# Altium schematic sheet 0258_GPU VREG_ VDDQ_GPU.SchDoc
size 848 x 558 mm
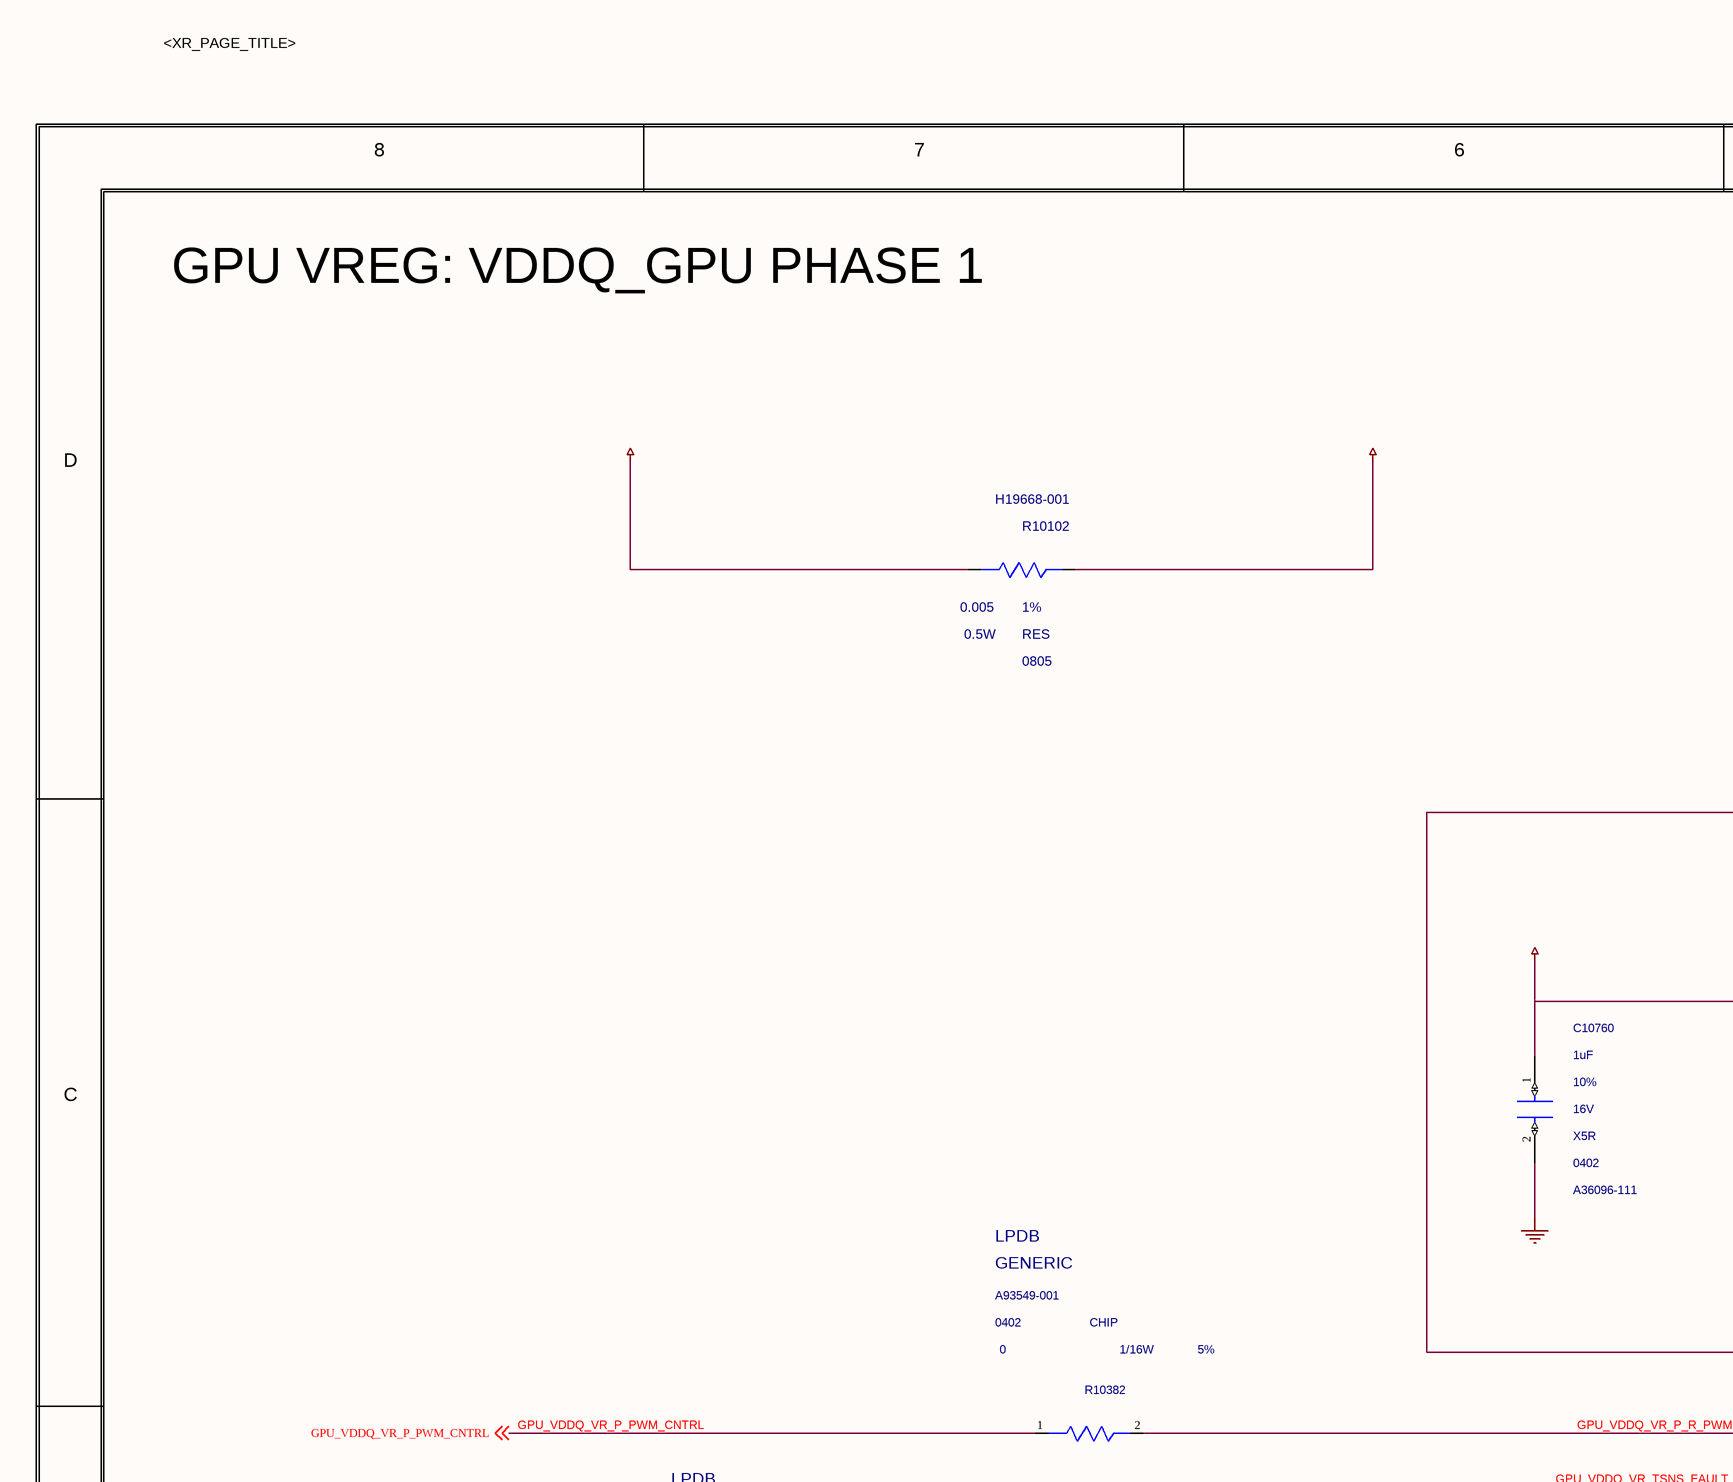
[diagram p0: 0258_GPU VREG_ VDDQ_GPU.SchDoc, top left]
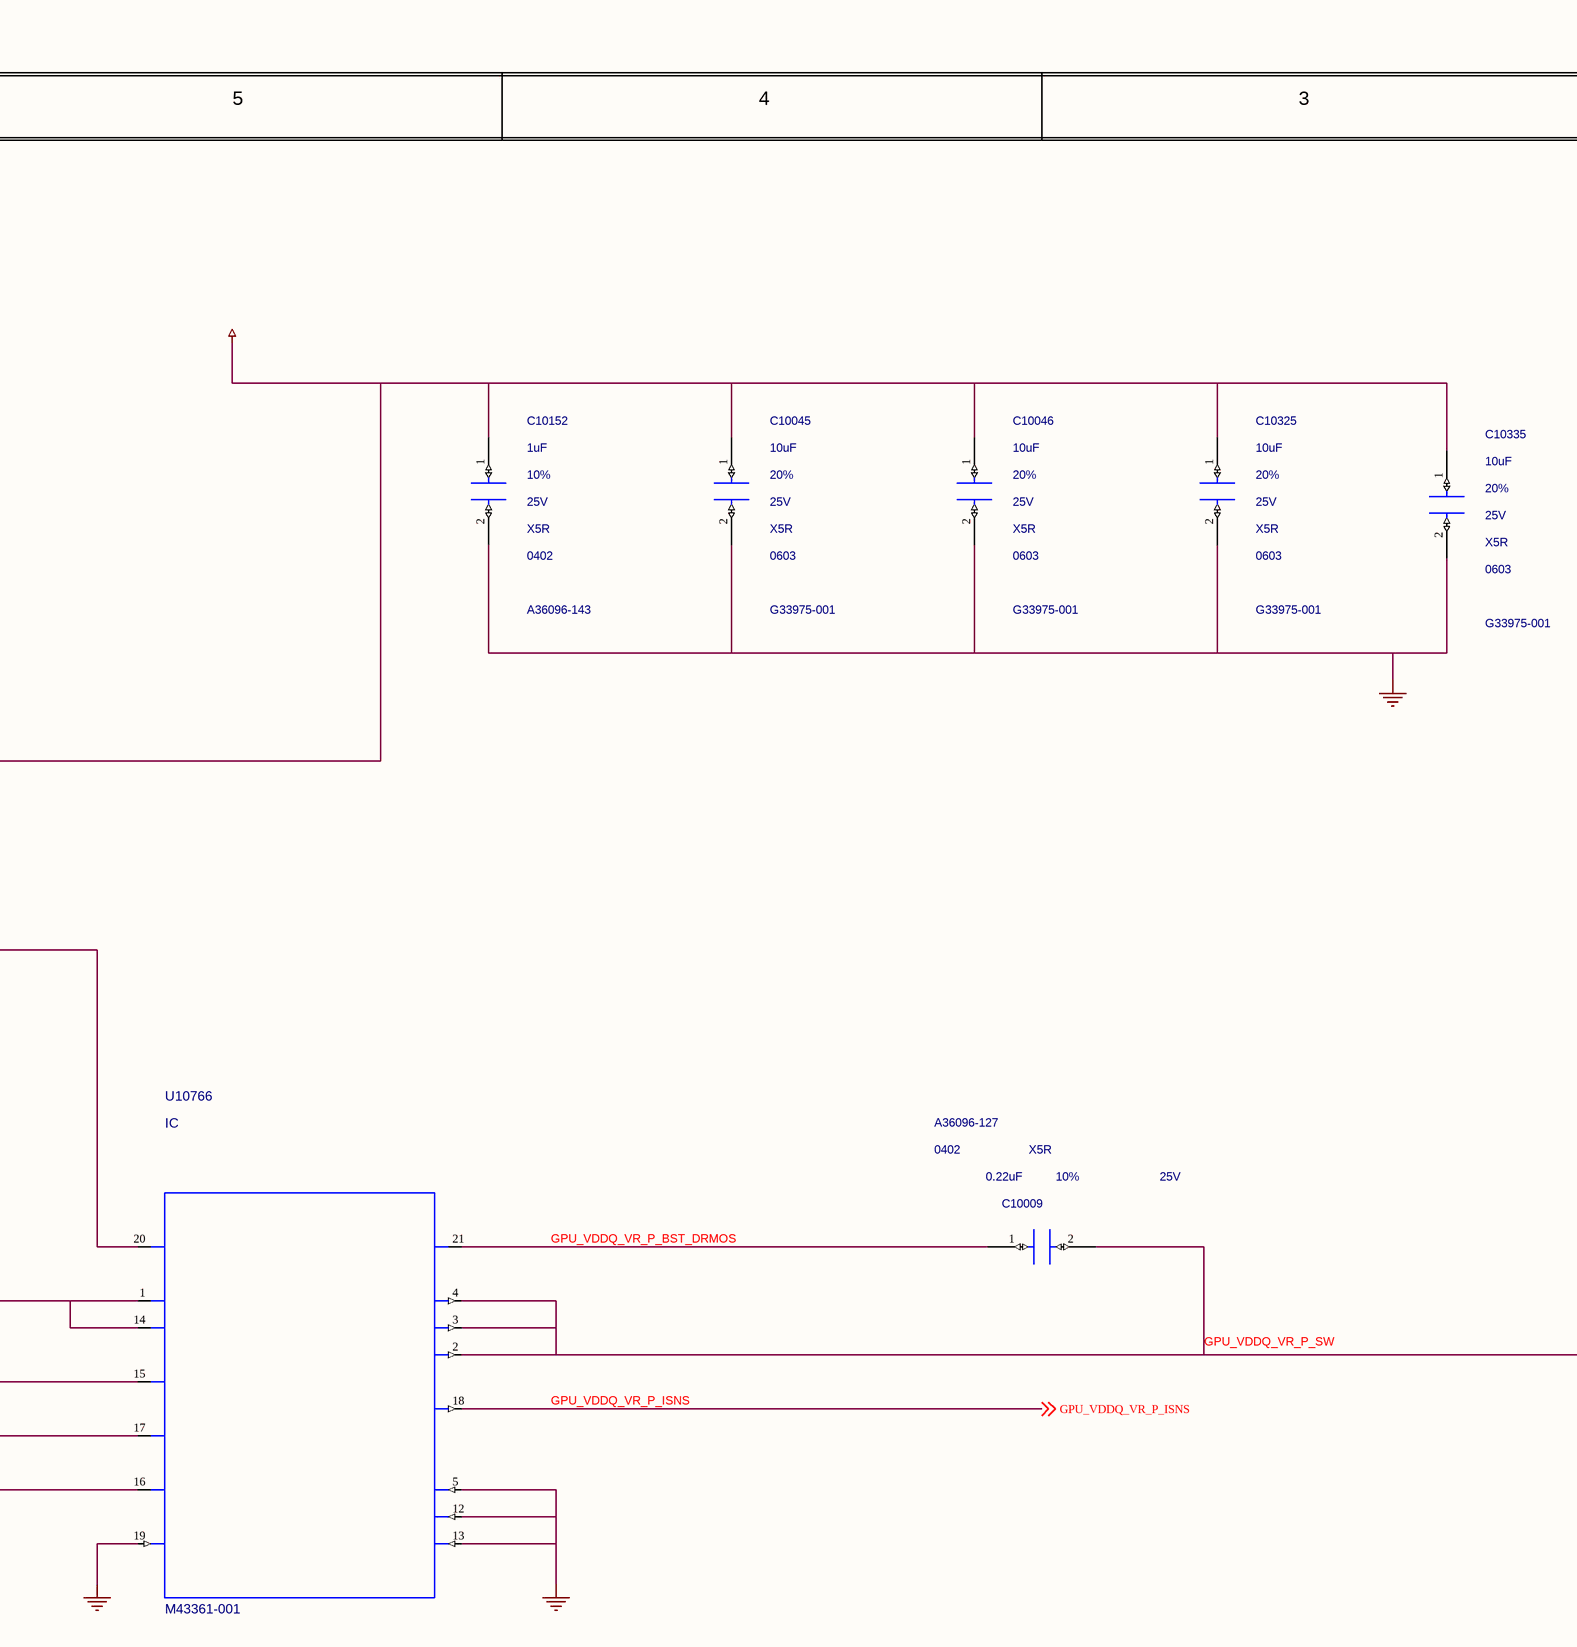
[diagram p1: 0258_GPU VREG_ VDDQ_GPU.SchDoc, top middle]
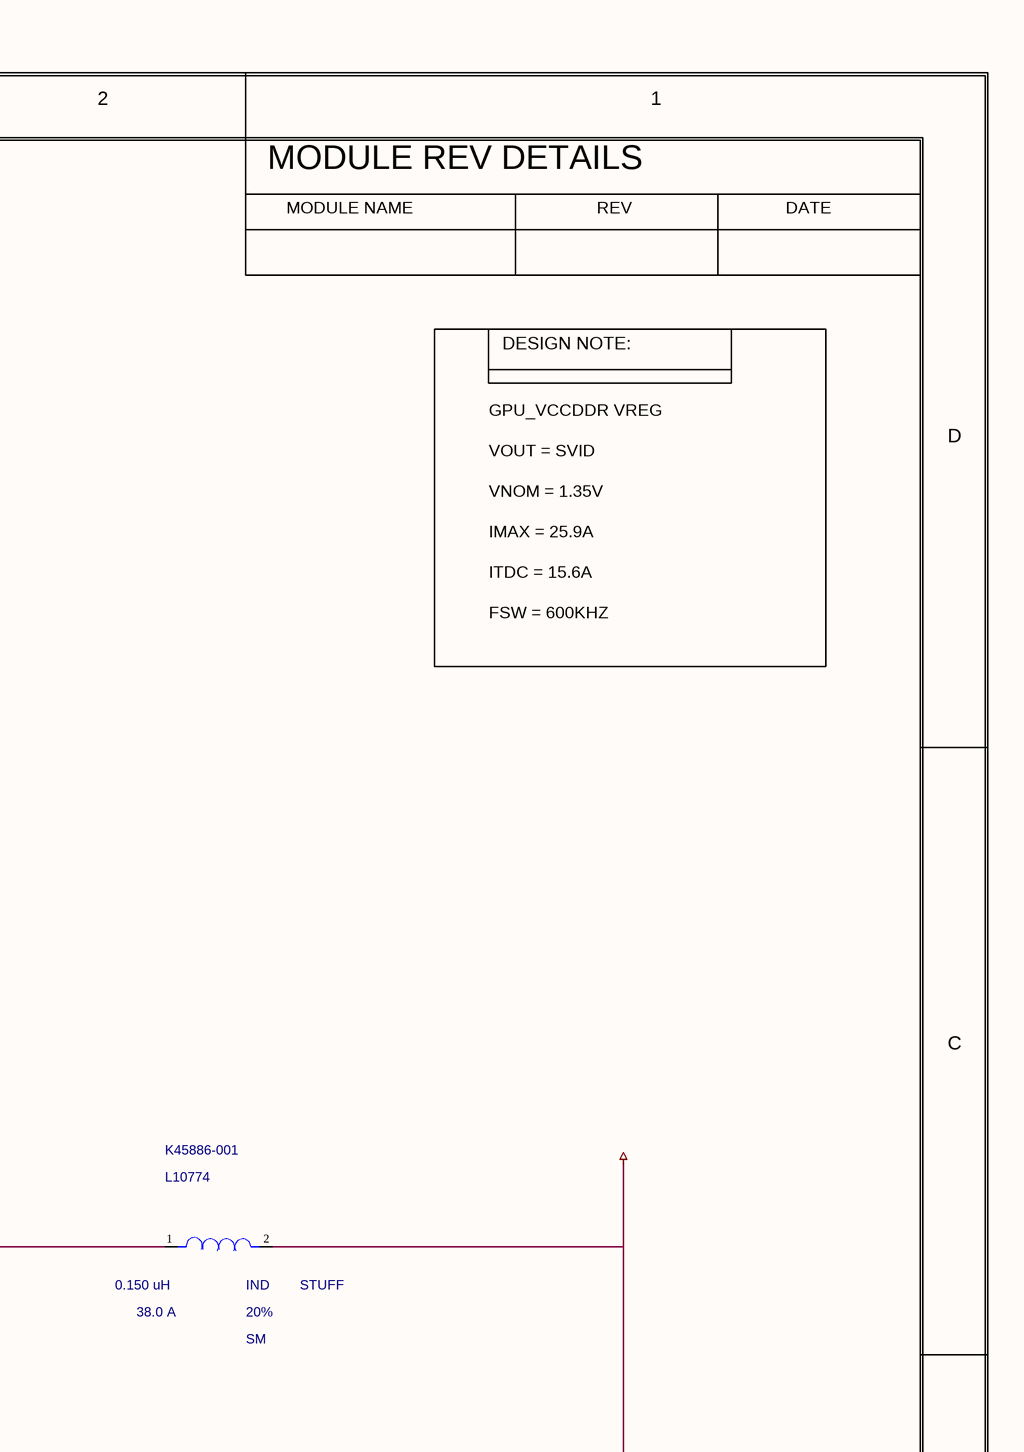
[diagram p2: 0258_GPU VREG_ VDDQ_GPU.SchDoc, top right]
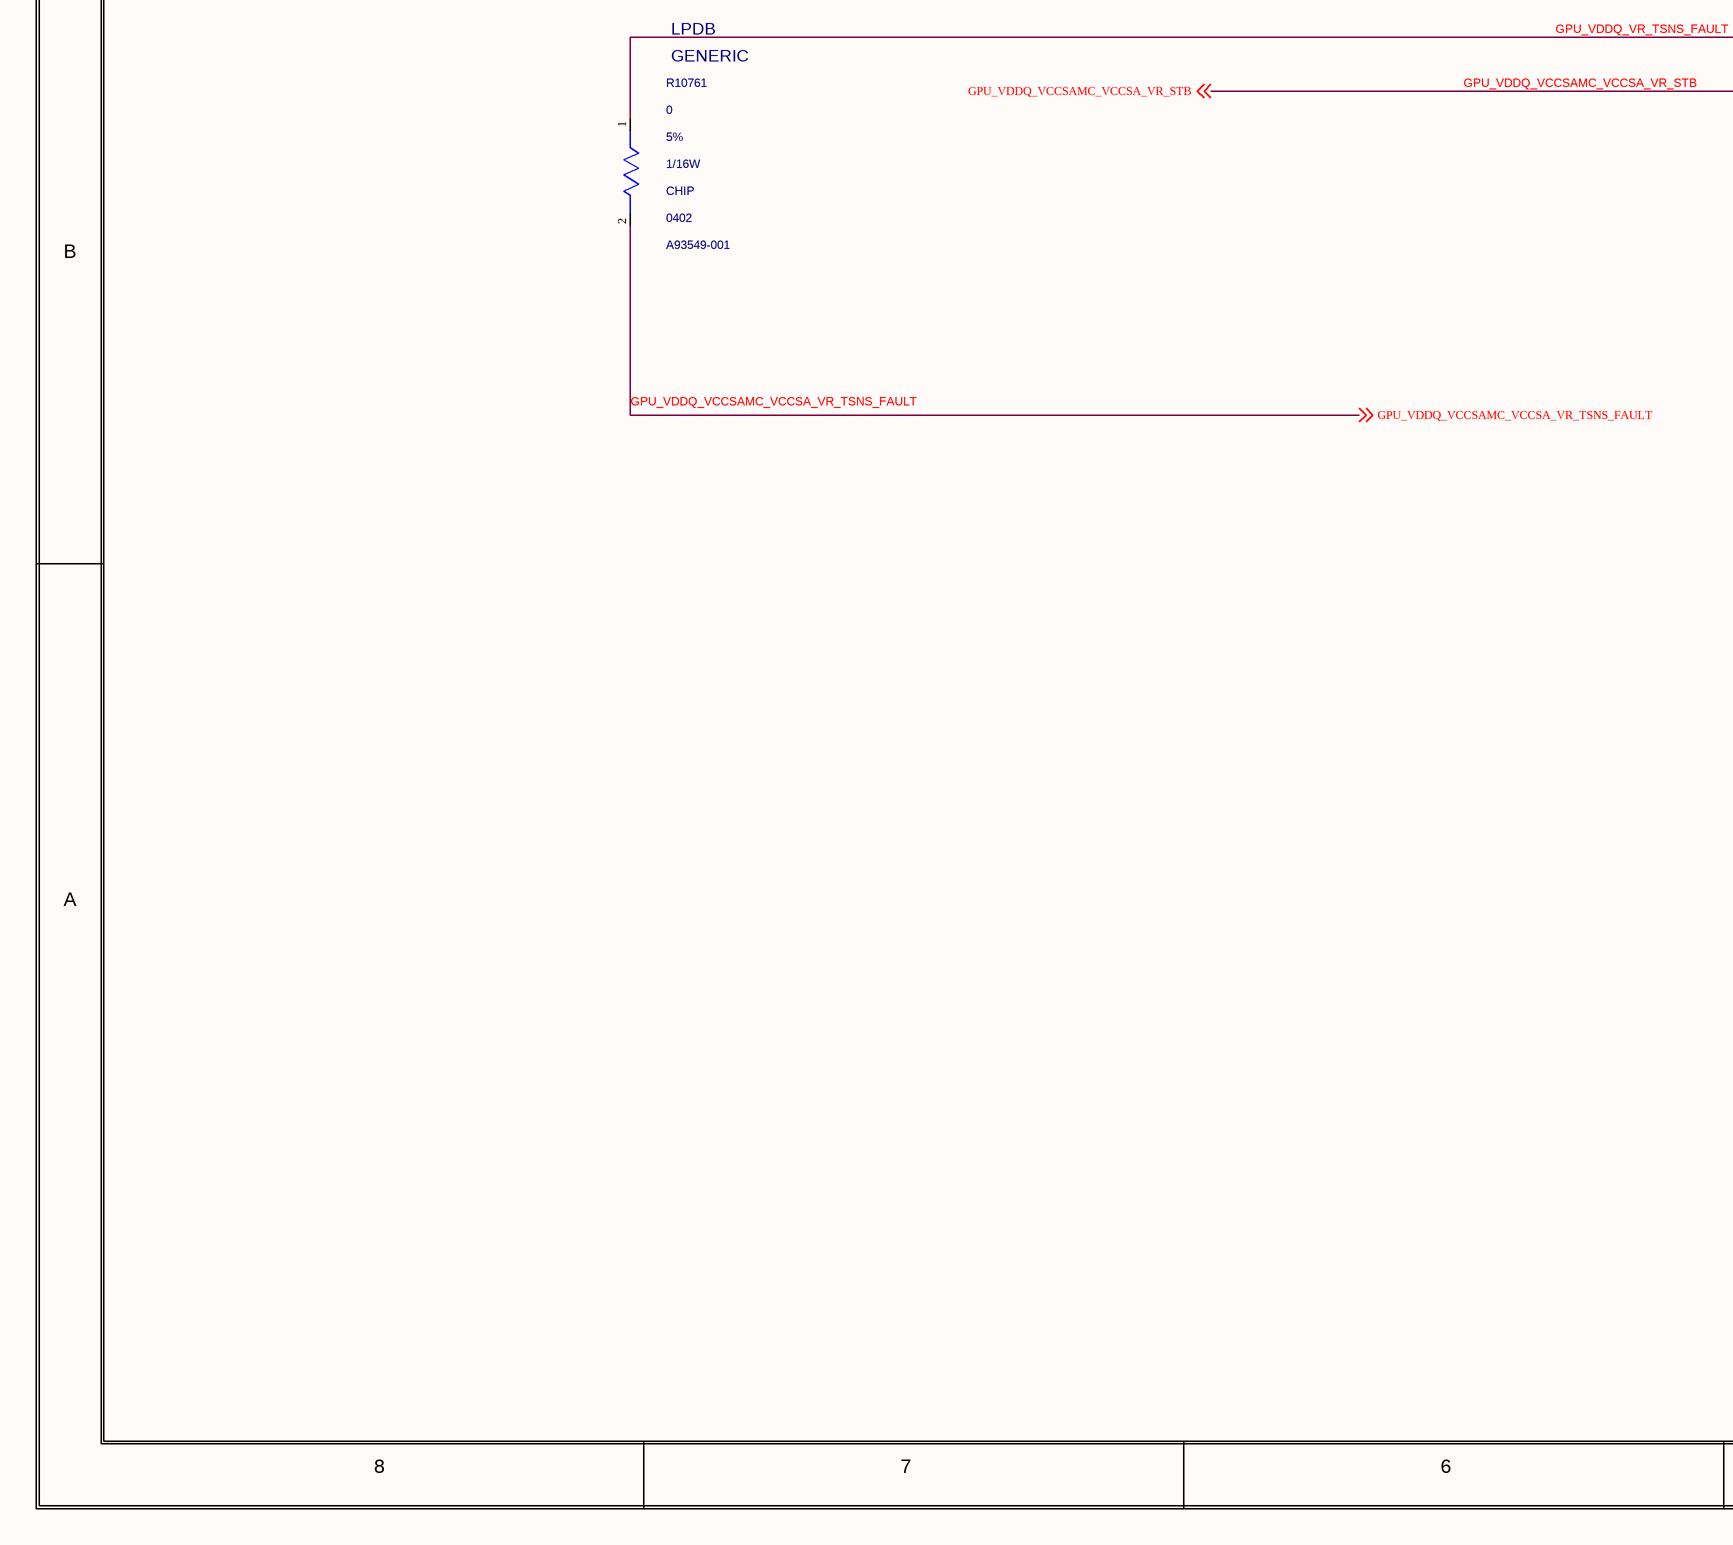
[diagram p3: 0258_GPU VREG_ VDDQ_GPU.SchDoc, bottom left]
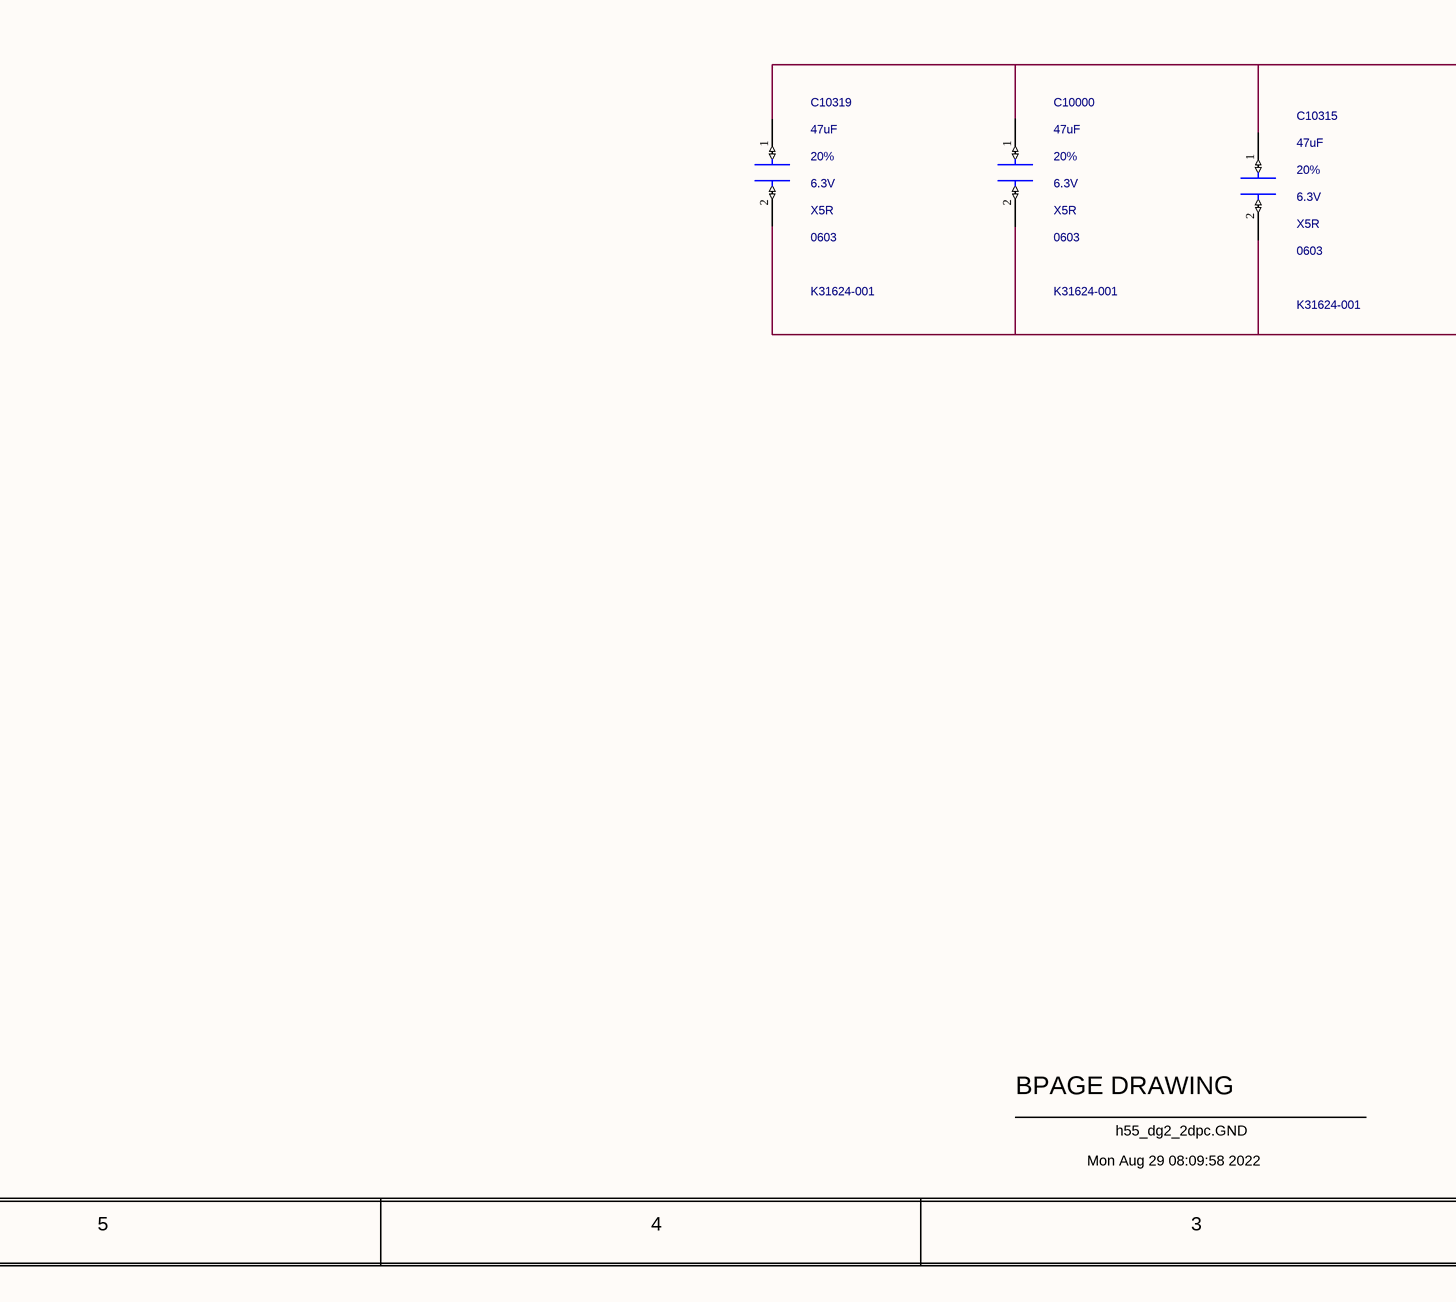
[diagram p4: 0258_GPU VREG_ VDDQ_GPU.SchDoc, bottom middle]
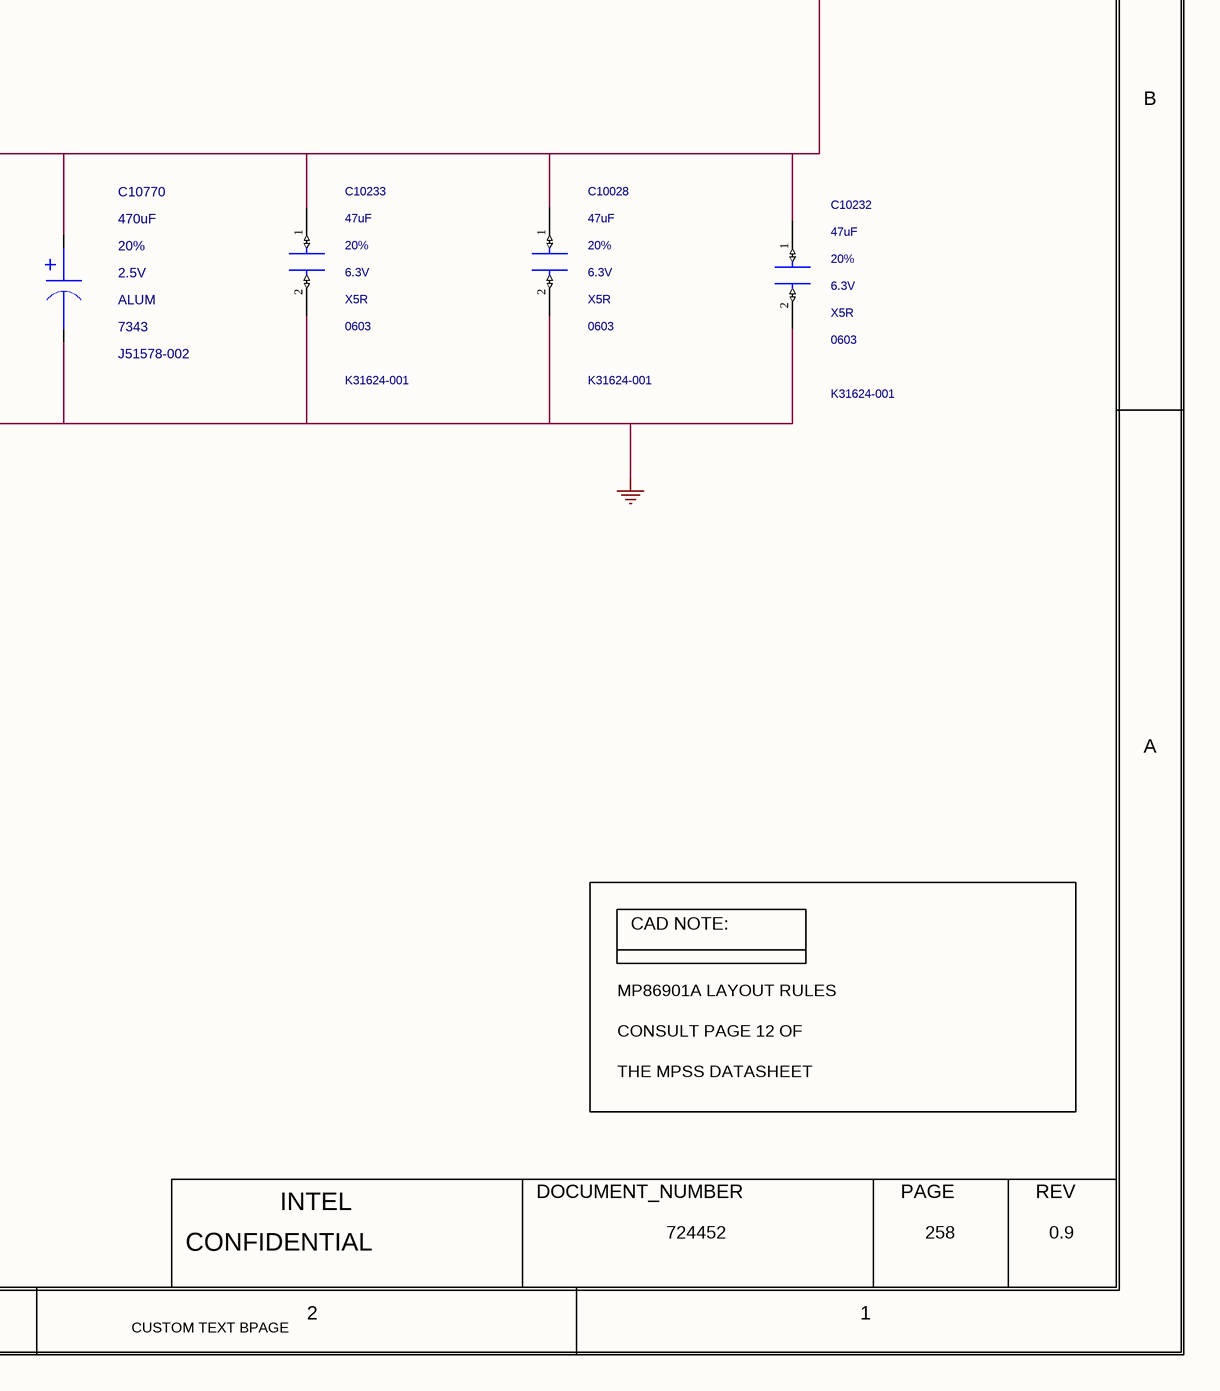
[diagram p5: 0258_GPU VREG_ VDDQ_GPU.SchDoc, bottom right]

## Parts
C10000  47uF  MATERIAL: X5R  PACK_TYPE: 0603  PART_NUMBER: K31624-001  TOLERANCE: 20%  VOLTAGE: 6.3V  [SMC0603ID]
C10009  0.22uF  MATERIAL: X5R  PACK_TYPE: 0402  PART_NUMBER: A36096-127  TOLERANCE: 10%  VOLTAGE: 25V  [SMC1005MB]
C10028  47uF  MATERIAL: X5R  PACK_TYPE: 0603  PART_NUMBER: K31624-001  TOLERANCE: 20%  VOLTAGE: 6.3V  [SMC0603ID]
C10045  10uF  MATERIAL: X5R  PACK_TYPE: 0603  PART_NUMBER: G33975-001  TOLERANCE: 20%  VOLTAGE: 25V  [SMC0603IA]
C10046  10uF  MATERIAL: X5R  PACK_TYPE: 0603  PART_NUMBER: G33975-001  TOLERANCE: 20%  VOLTAGE: 25V  [SMC0603IA]
C10152  1uF  MATERIAL: X5R  PACK_TYPE: 0402  PART_NUMBER: A36096-143  TOLERANCE: 10%  VOLTAGE: 25V  [SMC0402MA]
C10232  47uF  MATERIAL: X5R  PACK_TYPE: 0603  PART_NUMBER: K31624-001  TOLERANCE: 20%  VOLTAGE: 6.3V  [SMC0603ID]
C10233  47uF  MATERIAL: X5R  PACK_TYPE: 0603  PART_NUMBER: K31624-001  TOLERANCE: 20%  VOLTAGE: 6.3V  [SMC0603ID]
C10315  47uF  MATERIAL: X5R  PACK_TYPE: 0603  PART_NUMBER: K31624-001  TOLERANCE: 20%  VOLTAGE: 6.3V  [SMC0603ID]
C10319  47uF  MATERIAL: X5R  PACK_TYPE: 0603  PART_NUMBER: K31624-001  TOLERANCE: 20%  VOLTAGE: 6.3V  [SMC0603ID]
C10325  10uF  MATERIAL: X5R  PACK_TYPE: 0603  PART_NUMBER: G33975-001  TOLERANCE: 20%  VOLTAGE: 25V  [SMC0603IA]
C10335  10uF  MATERIAL: X5R  PACK_TYPE: 0603  PART_NUMBER: G33975-001  TOLERANCE: 20%  VOLTAGE: 25V  [SMC0603IA]
C10760  1uF  MATERIAL: X5R  PACK_TYPE: 0402  PART_NUMBER: A36096-111  TOLERANCE: 10%  VOLTAGE: 16V  [SMC0402IA]
C10770  470uF  MATERIAL: ALUM  PACK_TYPE: 7343  PART_NUMBER: J51578-002  TOLERANCE: 20%  VOLTAGE: 2.5V  [CTK2_SMC_7500X4500_ALEL_MA]
L10774  0.150 uH  BOM_USE: STUFF  CURRENT: 38.0 A  MATERIAL: IND  PACK_TYPE: SM  PART_NUMBER: K45886-001  TOLERANCE: 20%  [TK0_SMI_7600X6800_MA]
R10102  0.005  MATERIAL: RES  PACK_TYPE: 0805  PART_NUMBER: H19668-001  TOLERANCE: 1%  WATTAGE: 0.5W  [CTK2_SM0805_2150X1350_MA]
R10382  0  MATERIAL: CHIP  PACK_TYPE: 0402  PART_NUMBER: A93549-001  TOLERANCE: 5%  WATTAGE: 1/16W  IP: GENERIC  FP_TECH: LPDB  [SMR0402IA]
R10761  0  MATERIAL: CHIP  PACK_TYPE: 0402  PART_NUMBER: A93549-001  TOLERANCE: 5%  WATTAGE: 1/16W  IP: GENERIC  FP_TECH: LPDB  [SMR0402IA]
U10766  MATERIAL: IC  PART_NUMBER: M43361-001  [CTK1_LCC21_3100X5100_400_DF3P_MA_VR]  (hidden comment: C_MP86941)

## Nets
+V3P3S_GPU: C10760.1(A) U10766.20(VCC)
+VBATA_DG2: R10102.1(A)
+VBATA_VDDQ_GPU: C10045.1(A) C10046.1(A) C10152.1(A) C10325.1(A) C10335.1(A) R10102.2(B) U10766.1(VIN_1) U10766.14(VIN_2)
+VDDQ_GPU: C10000.1(A) C10028.1(A) C10232.1(A) C10233.1(A) C10315.1(A) C10319.1(A) C10770.1(A) L10774.2(INB)
GND: C10000.2(B) C10028.2(B) C10045.2(B) C10046.2(B) C10152.2(B) C10232.2(B) C10233.2(B) C10315.2(B) C10319.2(B) C10325.2(B) C10335.2(B) C10760.2(B) C10770.2(B) U10766.5(PGND_1) U10766.12(PGND_2) U10766.13(PGND_3) U10766.19(AGND)
GPU_VDDQ_VCCSAMC_VCCSA_VR_STB: U10766.16(SYNC) ; off-sheet GPU_VDDQ_VCCSAMC_VCCSA_VR_STB
GPU_VDDQ_VCCSAMC_VCCSA_VR_TSNS_FAULT: R10761.2(B) ; off-sheet GPU_VDDQ_VCCSAMC_VCCSA_VR_TSNS_FAULT
GPU_VDDQ_VR_P_BST_DRMOS: C10009.1(A) U10766.21(BST)
GPU_VDDQ_VR_P_ISNS: U10766.18(CS) ; off-sheet GPU_VDDQ_VR_P_ISNS
GPU_VDDQ_VR_P_PWM_CNTRL: R10382.1(A) ; off-sheet GPU_VDDQ_VR_P_PWM_CNTRL
GPU_VDDQ_VR_P_R_PWM: R10382.2(B) U10766.15(PWM)
GPU_VDDQ_VR_P_SW: C10009.2(B) L10774.1(INA) U10766.2(SW_1) U10766.3(SW_2) U10766.4(SW_3)
GPU_VDDQ_VR_TSNS_FAULT: R10761.1(A) U10766.17(VTEMP_FLT)

## Notes on the sheet
- <XR_PAGE_TITLE>
- 8
- 7
- 6
- 5
- 4
- 3
- 2
- 1
- MODULE REV DETAILS
- GPU VREG: VDDQ_GPU PHASE 1
- MODULE NAME
- REV
- DATE
- DESIGN NOTE:
- D
- GPU_VCCDDR VREG
- VOUT = SVID
- VNOM = 1.35V
- IMAX = 25.9A
- ITDC = 15.6A
- FSW = 600KHZ
- C
- B
- A
- CAD NOTE:
- MP86901A LAYOUT RULES
- CONSULT PAGE 12 OF
- THE MPSS DATASHEET
- BPAGE DRAWING
- INTEL
- DOCUMENT_NUMBER
- PAGE
- Mon Aug 29 08:09:58 2022
- h55_dg2_2dpc.GND
- CONFIDENTIAL
- 724452
- 258
- 0.9
- CUSTOM TEXT BPAGE

## Library data of the parts
C10000 = CAP: CDS_PHYS_PART_NAME: CAP_0603-K31624-001,X5R,47UF,6.3V,20%,LPDB,GENERIC; OriginalSymbolOrigin: (-50,25); XY: (-2825,1900); VER: 1; ROT: 0; PHYS_PAGE: 258; LOCATION: C10000; DRAWING: @RVP1_ADL_SB_ADP_S_DDR5_SODIMM_2DPC_LIB.H55_DG2_2DPC(SCH_1):PAGE432; CDS_LIB: discrete; PCB Footprint: SMC0603ID; CHIPS_PART_NAME: CAP; CDS_PART_NAME: CAP_0603-K31624-001,X5R,47UF,6.3V,20%,LPDB,GENERIC; CDS_LOCATION: C10000
C10009 = CAP#1: CHIPS_PART_NAME: CAP; CDS_PHYS_PART_NAME: CAP_0402-A36096-127,X5R,0.22UF,25V,10%,LPDB,GENERIC; OriginalSymbolOrigin: (-25,50); XY: (-3000,2950); VER: 2; ROT: 0; PHYS_PAGE: 258; LOCATION: C10009; DRAWING: @RVP1_ADL_SB_ADP_S_DDR5_SODIMM_2DPC_LIB.H55_DG2_2DPC(SCH_1):PAGE432; CDS_LIB: discrete; PCB Footprint: SMC1005MB; CDS_PART_NAME: CAP_0402-A36096-127,X5R,0.22UF,25V,10%,LPDB,GENERIC; CDS_LOCATION: C10009
C10028 = CAP: CDS_PHYS_PART_NAME: CAP_0603-K31624-001,X5R,47UF,6.3V,20%,LPDB,GENERIC; OriginalSymbolOrigin: (-50,25); XY: (-1050,1900); VER: 1; ROT: 0; PHYS_PAGE: 258; LOCATION: C10028; DRAWING: @RVP1_ADL_SB_ADP_S_DDR5_SODIMM_2DPC_LIB.H55_DG2_2DPC(SCH_1):PAGE432; CDS_LIB: discrete; PCB Footprint: SMC0603ID; CHIPS_PART_NAME: CAP; CDS_PART_NAME: CAP_0603-K31624-001,X5R,47UF,6.3V,20%,LPDB,GENERIC; CDS_LOCATION: C10028
C10045 = CAP: CDS_PHYS_PART_NAME: CAP_0603-G33975-001,X5R,10UF,25V,20%,LPDB,GENERIC; OriginalSymbolOrigin: (-50,25); XY: (-3575,4350); VER: 1; ROT: 0; PHYS_PAGE: 258; LOCATION: C10045; DRAWING: @RVP1_ADL_SB_ADP_S_DDR5_SODIMM_2DPC_LIB.H55_DG2_2DPC(SCH_1):PAGE432; CDS_LIB: discrete; PCB Footprint: SMC0603IA; CHIPS_PART_NAME: CAP; CDS_PART_NAME: CAP_0603-G33975-001,X5R,10UF,25V,20%,LPDB,GENERIC; CDS_LOCATION: C10045
C10046 = CAP: CDS_PHYS_PART_NAME: CAP_0603-G33975-001,X5R,10UF,25V,20%,LPDB,GENERIC; OriginalSymbolOrigin: (-50,25); XY: (-3125,4350); VER: 1; ROT: 0; PHYS_PAGE: 258; LOCATION: C10046; DRAWING: @RVP1_ADL_SB_ADP_S_DDR5_SODIMM_2DPC_LIB.H55_DG2_2DPC(SCH_1):PAGE432; CDS_LIB: discrete; PCB Footprint: SMC0603IA; CHIPS_PART_NAME: CAP; CDS_PART_NAME: CAP_0603-G33975-001,X5R,10UF,25V,20%,LPDB,GENERIC; CDS_LOCATION: C10046
C10152 = CAP: CDS_PHYS_PART_NAME: CAP_0402-A36096-143,X5R,1UF,25V,10%,LPDB,GENERIC; OriginalSymbolOrigin: (-50,25); XY: (-4025,4350); VER: 1; ROT: 0; PHYS_PAGE: 258; LOCATION: C10152; DRAWING: @RVP1_ADL_SB_ADP_S_DDR5_SODIMM_2DPC_LIB.H55_DG2_2DPC(SCH_1):PAGE432; CDS_LIB: discrete; PCB Footprint: SMC0402MA; CHIPS_PART_NAME: CAP; CDS_PART_NAME: CAP_0402-A36096-143,X5R,1UF,25V,10%,LPDB,GENERIC; CDS_LOCATION: C10152
C10232 = CAP: CDS_PHYS_PART_NAME: CAP_0603-K31624-001,X5R,47UF,6.3V,20%,LPDB,GENERIC; OriginalSymbolOrigin: (-50,25); XY: (-600,1875); VER: 1; ROT: 0; PHYS_PAGE: 258; LOCATION: C10232; DRAWING: @RVP1_ADL_SB_ADP_S_DDR5_SODIMM_2DPC_LIB.H55_DG2_2DPC(SCH_1):PAGE432; CDS_LIB: discrete; PCB Footprint: SMC0603ID; CHIPS_PART_NAME: CAP; CDS_PART_NAME: CAP_0603-K31624-001,X5R,47UF,6.3V,20%,LPDB,GENERIC; CDS_LOCATION: C10232
C10233 = CAP: CDS_PHYS_PART_NAME: CAP_0603-K31624-001,X5R,47UF,6.3V,20%,LPDB,GENERIC; OriginalSymbolOrigin: (-50,25); XY: (-1500,1900); VER: 1; ROT: 0; PHYS_PAGE: 258; LOCATION: C10233; DRAWING: @RVP1_ADL_SB_ADP_S_DDR5_SODIMM_2DPC_LIB.H55_DG2_2DPC(SCH_1):PAGE432; CDS_LIB: discrete; PCB Footprint: SMC0603ID; CHIPS_PART_NAME: CAP; CDS_PART_NAME: CAP_0603-K31624-001,X5R,47UF,6.3V,20%,LPDB,GENERIC; CDS_LOCATION: C10233
C10315 = CAP: CDS_PHYS_PART_NAME: CAP_0603-K31624-001,X5R,47UF,6.3V,20%,LPDB,GENERIC; OriginalSymbolOrigin: (-50,25); XY: (-2375,1875); VER: 1; ROT: 0; PHYS_PAGE: 258; LOCATION: C10315; DRAWING: @RVP1_ADL_SB_ADP_S_DDR5_SODIMM_2DPC_LIB.H55_DG2_2DPC(SCH_1):PAGE432; CDS_LIB: discrete; PCB Footprint: SMC0603ID; CHIPS_PART_NAME: CAP; CDS_PART_NAME: CAP_0603-K31624-001,X5R,47UF,6.3V,20%,LPDB,GENERIC; CDS_LOCATION: C10315
C10319 = CAP: CDS_PHYS_PART_NAME: CAP_0603-K31624-001,X5R,47UF,6.3V,20%,LPDB,GENERIC; OriginalSymbolOrigin: (-50,25); XY: (-3275,1900); VER: 1; ROT: 0; PHYS_PAGE: 258; LOCATION: C10319; DRAWING: @RVP1_ADL_SB_ADP_S_DDR5_SODIMM_2DPC_LIB.H55_DG2_2DPC(SCH_1):PAGE432; CDS_LIB: discrete; PCB Footprint: SMC0603ID; CHIPS_PART_NAME: CAP; CDS_PART_NAME: CAP_0603-K31624-001,X5R,47UF,6.3V,20%,LPDB,GENERIC; CDS_LOCATION: C10319
C10325 = CAP: CDS_PHYS_PART_NAME: CAP_0603-G33975-001,X5R,10UF,25V,20%,LPDB,GENERIC; OriginalSymbolOrigin: (-50,25); XY: (-2675,4350); VER: 1; ROT: 0; PHYS_PAGE: 258; LOCATION: C10325; DRAWING: @RVP1_ADL_SB_ADP_S_DDR5_SODIMM_2DPC_LIB.H55_DG2_2DPC(SCH_1):PAGE432; CDS_LIB: discrete; PCB Footprint: SMC0603IA; CHIPS_PART_NAME: CAP; CDS_PART_NAME: CAP_0603-G33975-001,X5R,10UF,25V,20%,LPDB,GENERIC; CDS_LOCATION: C10325
C10335 = CAP: CDS_PHYS_PART_NAME: CAP_0603-G33975-001,X5R,10UF,25V,20%,LPDB,GENERIC; OriginalSymbolOrigin: (-50,25); XY: (-2250,4325); VER: 1; ROT: 0; PHYS_PAGE: 258; LOCATION: C10335; DRAWING: @RVP1_ADL_SB_ADP_S_DDR5_SODIMM_2DPC_LIB.H55_DG2_2DPC(SCH_1):PAGE432; CDS_LIB: discrete; PCB Footprint: SMC0603IA; CHIPS_PART_NAME: CAP; CDS_PART_NAME: CAP_0603-G33975-001,X5R,10UF,25V,20%,LPDB,GENERIC; CDS_LOCATION: C10335
C10760 = CAP: CDS_PHYS_PART_NAME: CAP_0402-A36096-111,X5R,1UF,16V,10%,LPDB,GENERIC; OriginalSymbolOrigin: (-50,25); XY: (-5350,3300); VER: 1; ROT: 0; PHYS_PAGE: 258; LOCATION: C10760; DRAWING: @RVP1_ADL_SB_ADP_S_DDR5_SODIMM_2DPC_LIB.H55_DG2_2DPC(SCH_1):PAGE432; CDS_LIB: discrete; PCB Footprint: SMC0402IA; CHIPS_PART_NAME: CAP; CDS_PART_NAME: CAP_0402-A36096-111,X5R,1UF,16V,10%,LPDB,GENERIC; CDS_LOCATION: C10760
C10770 = C_CAPP: CDS_PHYS_PART_NAME: C_CAPP_7343-J51578-002,ALUM,470UF,2.5V,20%,TK2,GENERIC; CDS_LMAN_SYM_OUTLINE: -50,100,50,-50; FP_TECH: TK2; IP: GENERIC; ROOM: NONE; OriginalSymbolOrigin: (-50,75); XY: (-1950,1850); VER: 1; ROT: 0; PHYS_PAGE: 258; LOCATION: C10770; DRAWING: @RVP1_ADL_SB_ADP_S_DDR5_SODIMM_2DPC_LIB.H55_DG2_2DPC(SCH_1):PAGE432; CDS_LIB: c_discrete; VARIANT: ?; PCB Footprint: CTK2_SMC_7500X4500_ALEL_MA; CHIPS_PART_NAME: C_CAPP; CDS_PART_NAME: C_CAPP_7343-J51578-002,ALUM,470UF,2.5V,20%,TK2,GENERIC; CDS_LOCATION: C10770
L10774 = INDUCTOR_2: CDS_PHYS_PART_NAME: INDUCTOR_2_SM-K45886-001,IND,0.150 UH,20%,38.0 A,TK0,GENERIC; CDS_LMAN_SYM_OUTLINE: -100,50,100,-50; FP_TECH: TK0; IP: GENERIC; ROOM: NONE; OriginalSymbolOrigin: (-75,25); XY: (-1300,2950); VER: 1; ROT: 0; PHYS_PAGE: 258; LOCATION: L10774; DRAWING: @RVP1_ADL_SB_ADP_S_DDR5_SODIMM_2DPC_LIB.H55_DG2_2DPC(SCH_1):PAGE432; CDS_LIB: discrete_2; VARIANT: ?; PCB Footprint: TK0_SMI_7600X6800_MA; CHIPS_PART_NAME: INDUCTOR_2; CDS_PART_NAME: INDUCTOR_2_SM-K45886-001,IND,0.150 UH,20%,38.0 A,TK0,GENERIC; CDS_LOCATION: L10774
R10102 = C_RES#1: CHIPS_PART_NAME: C_RES; CDS_PHYS_PART_NAME: C_RES_0805-H19668-001,RES,0.005,1%,0.5W,TK2,GENERIC; CDS_LMAN_SYM_OUTLINE: -50,50,50,-50; FP_TECH: TK2; IP: GENERIC; ROOM: NONE; OriginalSymbolOrigin: (-75,25); XY: (-6300,4300); VER: 1; ROT: 0; PHYS_PAGE: 258; LOCATION: R10102; DRAWING: @RVP1_ADL_SB_ADP_S_DDR5_SODIMM_2DPC_LIB.H55_DG2_2DPC(SCH_1):PAGE432; CDS_LIB: c_discrete; VARIANT: ?; PCB Footprint: CTK2_SM0805_2150X1350_MA; CDS_PART_NAME: C_RES_0805-H19668-001,RES,0.005,1%,0.5W,TK2,GENERIC; CDS_LOCATION: R10102
R10382 = RES#1: CHIPS_PART_NAME: RES; CDS_PHYS_PART_NAME: RES_0402-A93549-001,CHIP,0,5%,1/16W,LPDB,GENERIC; OriginalSymbolOrigin: (-75,25); XY: (-6175,2700); VER: 1; PHYS_PAGE: 258; LOCATION: R10382; DRAWING: @RVP1_ADL_SB_ADP_S_DDR5_SODIMM_2DPC_LIB.H55_DG2_2DPC(SCH_1):PAGE432; CDS_LIB: discrete; PCB Footprint: SMR0402IA; ROT: 0; CDS_PART_NAME: RES_0402-A93549-001,CHIP,0,5%,1/16W,LPDB,GENERIC; CDS_LOCATION: R10382
R10761 = RES: CDS_PHYS_PART_NAME: RES_0402-A93549-001,CHIP,0,5%,1/16W,LPDB,GENERIC; OriginalSymbolOrigin: (-25,75); XY: (-7025,2350); VER: 2; SUB_ROOM: VCCSA; PHYS_PAGE: 258; LOCATION: R10761; DRAWING: @RVP1_ADL_SB_ADP_S_DDR5_SODIMM_2DPC_LIB.H55_DG2_2DPC(SCH_1):PAGE432; CDS_LIB: discrete; PCB Footprint: SMR0402IA; ROT: 0; CHIPS_PART_NAME: RES; CDS_PART_NAME: RES_0402-A93549-001,CHIP,0,5%,1/16W,LPDB,GENERIC; CDS_LOCATION: R10761
U10766 = C_MP86941: CDS_PHYS_PART_NAME: C_MP86941_LCC-M43361-001,IC,MP86941-CGQVT,TK1,GENERIC; CDS_LMAN_SYM_OUTLINE: -250,400,250,-350; FP_TECH: TK1; IP: GENERIC; PACK_TYPE: LCC; ROOM: NONE; OriginalSymbolOrigin: (-275,400); XY: (-4375,2650); VER: 1; ROT: 0; PHYS_PAGE: 258; LOCATION: U10766; DRAWING: @RVP1_ADL_SB_ADP_S_DDR5_SODIMM_2DPC_LIB.H55_DG2_2DPC(SCH_1):PAGE432; CDS_LIB: local; VARIANT: ?; PCB Footprint: CTK1_LCC21_3100X5100_400_DF3P_MA_VR; CHIPS_PART_NAME: C_MP86941; CDS_PART_NAME: C_MP86941_LCC-M43361-001,IC,MP86941-CGQVT,TK1,GENERIC; CDS_LOCATION: U10766